# EAGLE design IoT_modules_atmega328_kinemata_v2 (EAGLE 7.2.0)
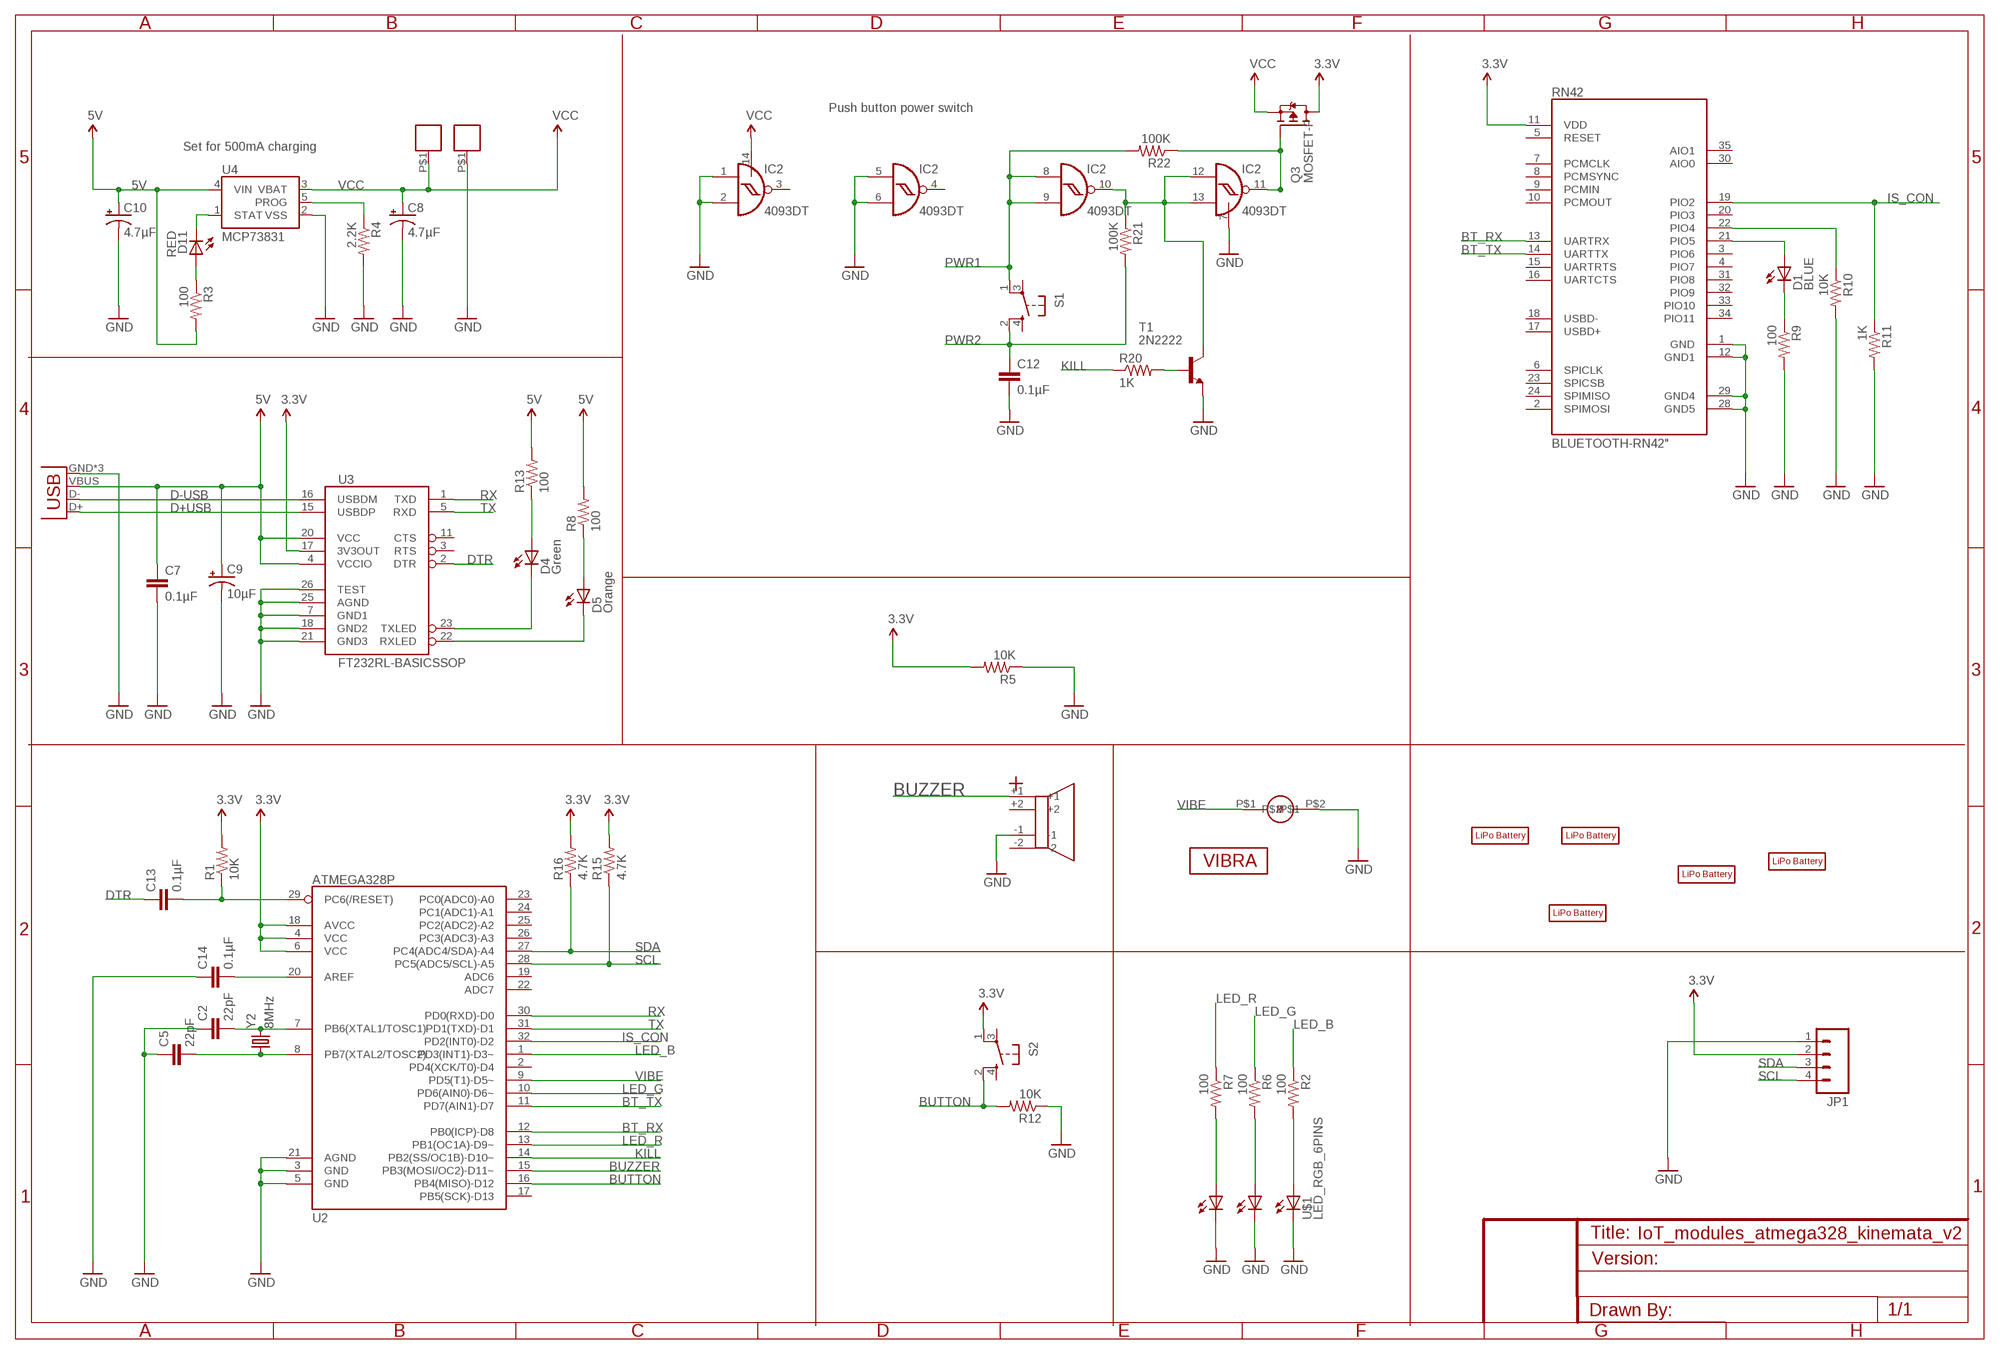
[diagram p0: schematic, sheet 1]

## Parts
BAT+2  LIPO_PAD  [LIPO_PAD]
BAT-1  LIPO_PAD  [LIPO_PAD]
C2  22pF  CAP1206  [1206]
C5  22pF  CAP1206  [1206]
C7  0.1µF  CAP1206  [1206]
C8  4.7µF  CAP_POL1206  [EIA3216]
C9  10µF  CAP_POL1206  [EIA3216]
C10  4.7µF  CAP_POL1206  [EIA3216]
C12  0.1µF  CAP1206  [1206]
C13  0.1µF  CAP1206  [1206]
C14  0.1µF  CAP1206  [1206]
D1  BLUE  LED1206  [LED-1206]
D4  Green  LED1206  [LED-1206]
D5  Orange  LED1206  [LED-1206]
D11  RED  LED1206  [LED-1206]
IC2  4093DT  [MC14093B-TSSOP14]
JP1  M04LONGPADS  [1X04_LONGPADS]
JP6  USB-MICROB  [USB-MICROB]
Q3  MOSFET-P  [SOT23]
R1  10K  RESISTOR1206  [1206]
R2  100  RESISTOR1206  [1206]
R3  100  RESISTOR1206  [1206]
R4  2.2K  RESISTOR1206  [1206]
R5  10K  RESISTOR1206  [1206]
R6  100  RESISTOR1206  [1206]
R7  100  RESISTOR1206  [1206]
R8  100  RESISTOR1206  [1206]
R9  100  RESISTOR1206  [1206]
R10  10K  RESISTOR1206  [1206]
R11  1K  RESISTOR1206  [1206]
R12  10K  RESISTOR1206  [1206]
R13  100  RESISTOR1206  [1206]
R15  4.7K  RESISTOR1206  [1206]
R16  4.7K  RESISTOR1206  [1206]
R20  1K  RESISTOR1206  [1206]
R21  100K  RESISTOR1206  [1206]
R22  100K  RESISTOR1206  [1206]
RN42  BLUETOOTH-RN42"  [RN42]
S1  TAC_SWITCH_SIDEWAY  [TACTILE_SWITCH_ANGLE_SMD]
S2  TAC_SWITCH_SIDEWAY  [TACTILE_SWITCH_ANGLE_SMD]
T1  2N2222  [TO92-EBC-OVAL]
U2  ATMEGA328P  ATMEGA328_SMT  [TQFP32-08]
U3  FT232RL-BASICSSOP  [SSOP28DB]
U4  MCP73831  [SOT23-5]
U$1  LED_RGB_6PINS  [LED_RGB_6PINS]
U$2  LIPO_BATTERY110MAH  [LIPO_BATTERY_110MAH]
U$3  BUZZER_4PINS  [FARNELL_BUZZER_MAGNETIC_SMD_3V_2215091]
U$4  VIBRATION_MOTOR_SHAPE  [VIBRATION_MOTOR_SHAPE]
U$5  VIBRATION_MOTOR  [VIBRATION_MOTOR_CABLE]
U$6  LIPO_BATTERY300MAH  [LIPO_BATTERY_300MAH_FARNELL_2077884]
U$7  LIPO_BATTERY400MAH  [LIPO_BATTERY_400MAH]
U$8  LIPO_BATTERY600MAH  [LIPO_BATTERY_600MAH_FARNELL_2077883]
U$9  LIPO_BATTERY900MAH  [LIPO_BATTERY_900MAH]
Y2  8MHz  CRYSTAL_2PINS5X3.2  [CRYSTAL_8MHZ_SMD_FARNELL_2101329]

## Nets
3.3V: JP1.2 Q3.3(D) R1.2 R5.2 R15.2 R16.2 RN42.11(VDD) S2.1(A2) U2.4(VCC) U2.6(VCC) U2.18(AVCC) U3.17(3V3OUT)
5V: C7.1 C9.A(+) C10.A(+) JP6.VBUS R3.2 R8.2 R13.2 U3.4(VCCIO) U3.20(VCC) U4.4(VIN)
BT_RX: RN42.13(UARTRX) U2.12(PB0(ICP)-D8)
BT_TX: RN42.14(UARTTX) U2.11(PD7(AIN1)-D7)
BUTTON: R12.2 S2.2(B2) U2.16(PB4(MISO)-D12)
BUZZER: U2.15(PB3(MOSI/OC2)-D11~) U$3.+1
D+USB: JP6.D+ U3.15(USBDP)
D-USB: JP6.D- U3.16(USBDM)
DTR: C13.1 U3.2(DTR)
GND: BAT-1.P$1 C2.1 C5.1 C7.2 C8.C(-) C9.C(-) C10.C(-) C12.2 C14.1 IC2.1 IC2.2 IC2.5 IC2.6 IC2.7 JP1.1 JP6.GND JP6.MT1(GND) JP6.MT2(GND) R4.2 R5.1 R9.2 R10.2 R11.2 R12.1 RN42.1(GND) RN42.12(GND1) RN42.28(GND5) RN42.29(GND4) T1.E U2.3(GND) U2.5(GND) U2.21(AGND) U3.7(GND1) U3.18(GND2) U3.21(GND3) U3.25(AGND) U3.26(TEST) U4.2(VSS) U$1.BC U$1.GC U$1.RC U$3.-1 U$5.P$2
IS_CON: R11.1 RN42.19(PIO2) U2.32(PD2(INT0)-D2)
KILL: R20.1 U2.14(PB2(SS/OC1B)-D10~)
LED_B: R2.1 U2.1(PD3(INT1)-D3~)
LED_G: R6.1 U2.10(PD6(AIN0)-D6~)
LED_R: R7.1 U2.13(PB1(OC1A)-D9~)
N$1: R7.2 U$1.BA
N$2: R2.2 U$1.GA
N$3: D11.A R3.1
N$4: R6.2 U$1.RA
N$7: D4.A R13.1
N$9: D5.A R8.1
N$12: R10.1 RN42.22(PIO4)
N$13: D1.A RN42.21(PIO5)
N$14: C5.2 U2.8(PB7(XTAL2/TOSC2)) Y2.P$1
N$16: C2.2 U2.7(PB6(XTAL1/TOSC1)) Y2.P$2
N$17: D1.C R9.1
N$18: C13.2 R1.1 U2.29(PC6(/RESET))
N$19: C14.2 U2.20(AREF)
N$23: IC2.10 IC2.12 IC2.13 R21.1 T1.C
N$24: R20.2 T1.B
N$27: IC2.11 Q3.1(G) R22.1
PROG: R4.1 U4.5(PROG)
PWR1: IC2.8 IC2.9 R22.2 S1.1(A2)
PWR2: C12.1 R21.2 S1.2(B2)
RX: U2.30(PD0(RXD)-D0) U3.1(TXD)
RXLED: D5.C U3.22(RXLED)
SCL: JP1.4 R15.1 U2.28(PC5(ADC5/SCL)-A5)
SDA: JP1.3 R16.1 U2.27(PC4(ADC4/SDA)-A4)
STAT: D11.C U4.1(STAT)
TX: U2.31(PD1(TXD)-D1) U3.5(RXD)
TXLED: D4.C U3.23(TXLED)
VCC: BAT+2.P$1 C8.A(+) IC2.14 Q3.2(S) U4.3(VBAT)
VIBE: U2.9(PD5(T1)-D5~) U$5.P$1
Unconnected: IC2.3 IC2.4 RN42.2(SPIMOSI) RN42.3(PIO6) RN42.4(PIO7) RN42.5(RESET) RN42.6(SPICLK) RN42.7(PCMCLK) RN42.8(PCMSYNC) RN42.9(PCMIN) RN42.10(PCMOUT) RN42.15(UARTRTS) RN42.16(UARTCTS) RN42.17(USBD+) RN42.18(USBD-) RN42.20(PIO3) RN42.23(SPICSB) RN42.24(SPIMISO) RN42.30(AIO0) RN42.31(PIO8) RN42.32(PIO9) RN42.33(PIO10) RN42.34(PIO11) RN42.35(AIO1) S1.3(A1) S1.4(B1) S2.3(A1) S2.4(B1) U2.2(PD4(XCK/T0)-D4) U2.17(PB5(SCK)-D13) U2.19(ADC6) U2.22(ADC7) U2.23(PC0(ADC0)-A0) U2.24(PC1(ADC1)-A1) U2.25(PC2(ADC2)-A2) U2.26(PC3(ADC3)-A3) U3.3(RTS) U3.11(CTS) U$3.+2 U$3.-2

## Notes on the sheet
- Push button power switch
- Set for 500mA charging

## Library data of the parts
BAT+2 BAT-1 = MlabPaja_v3:LIPO_PAD
C2 C5 C7 C12-C14 = SparkFun-Passives:CAP: Capacitor Standard 0603 ceramic capacitor, and 0.1" leaded capacitor.
C8-C10 = SparkFun-Passives:CAP_POL: Capacitor Polarized These are standard SMD and PTH capacitors. Normally 10uF, 47uF, and 100uF in electrolytic and tantalum varieties. Always verify the external diameter of the through hole cap, it varies with capacity, voltage, and manufacturer. The EIA devices should be standard.
D1 D4 D5 D11 = SparkFun-LED:LED: LEDs Standard schematic elements and footprints for 5mm, 3mm, 1206, and 0603 sized LEDs. 5mm - Spark Fun Electronics SKU : COM-00529 (and others)
IC2 = MlabPaja_v3:4093: Quad 2-input NAND schmitt trigger
JP1 = SparkFun-Connectors:M04: Header 4 Standard 4-pin 0.1" header. Use with straight break away headers (SKU : PRT-00116), right angle break away headers (PRT-00553), swiss pins (PRT-00743), machine pins (PRT-00117), and female headers (PRT-00115). Molex polarized connector foot print use with SKU : PRT-08231 with associated crimp pins and housings. 1MM SMD Version SKU: PRT-10208
JP6 = SparkFun-Connectors:USB: USB Connectors USB-B-PTH is fully proven SKU : PRT-00139/CONN-08278 USB-miniB is fully proven SKU : PRT-00587 USB-A-PCB is untested. USB-A-H is throughly reviewed, but untested. Spark Fun Electronics SKU : PRT-00437 USB-B-SMT is throughly reviewed, but untested. Needs silkscreen touching up. USB-A-S has not been used/tested USB-MB-H has not been used/tested USB-MICROB has been used. CONN-09505; PROD_ID: CONN-09505
Q3 = MlabPaja_v3:MOSFET-P
R1-R13 R15 R16 R20-R22 = SparkFun-Resistors:RESISTOR: Resistor Basic schematic elements and footprints for 0603, 1206, and PTH resistors.
RN42 = MlabPaja_v3:BLUETOOTH-RN42: Bluetooth SMD module
S1 S2 = MlabPaja_v3:TAC_SWITCH: Momentary Switch Button commonly used for reset or general input. Spark Fun Electronics SKU : COM-00097 SMT- SWCH-08247; PROD_ID: SWCH-08247
T1 = adafruit:2N2222: NPN TRANSISTOR Big oval pads
U2 = MlabPaja_v3:ATMEGA328_SMT: 32-Pin Atmega328 part Commonly used on Arduino compatible boards Available in QFP and QFN packages TQFP is IC-09069 QFN is non-stock; PROD_ID: IC-09069
U3 = SparkFun-DigitalIC:FT232RL-BASIC: USB UART This is the simplified version of the FT232RL unit. Only what you need, nothing you don't. Spark Fun Electronics SKU : COM-00650
U4 = SparkFun:MCP73831: Microchip's MCP73831 Miniature single cell, fully integrated Li-Ion, Li-polymer charge management controller http://ww1.microchip.com/downloads/en/DeviceDoc/21984a.pdf
U$1 = Mlab_ProEx2015:LED_RGB_6PINS
U$2 U$6-U$9 = MlabPaja_v3:LIPO_BATTERY
U$3 = MlabPaja_v2:BUZZER_4PINS
U$4 = MlabPaja_v3:VIBRATION_MOTOR_SHAPE
U$5 = MlabPaja_v3:VIBRATION_MOTOR
Y2 = MlabPaja_v2:CRYSTAL_2PINS

## Net classes
0 default: clearance 0.21 mm

## Board
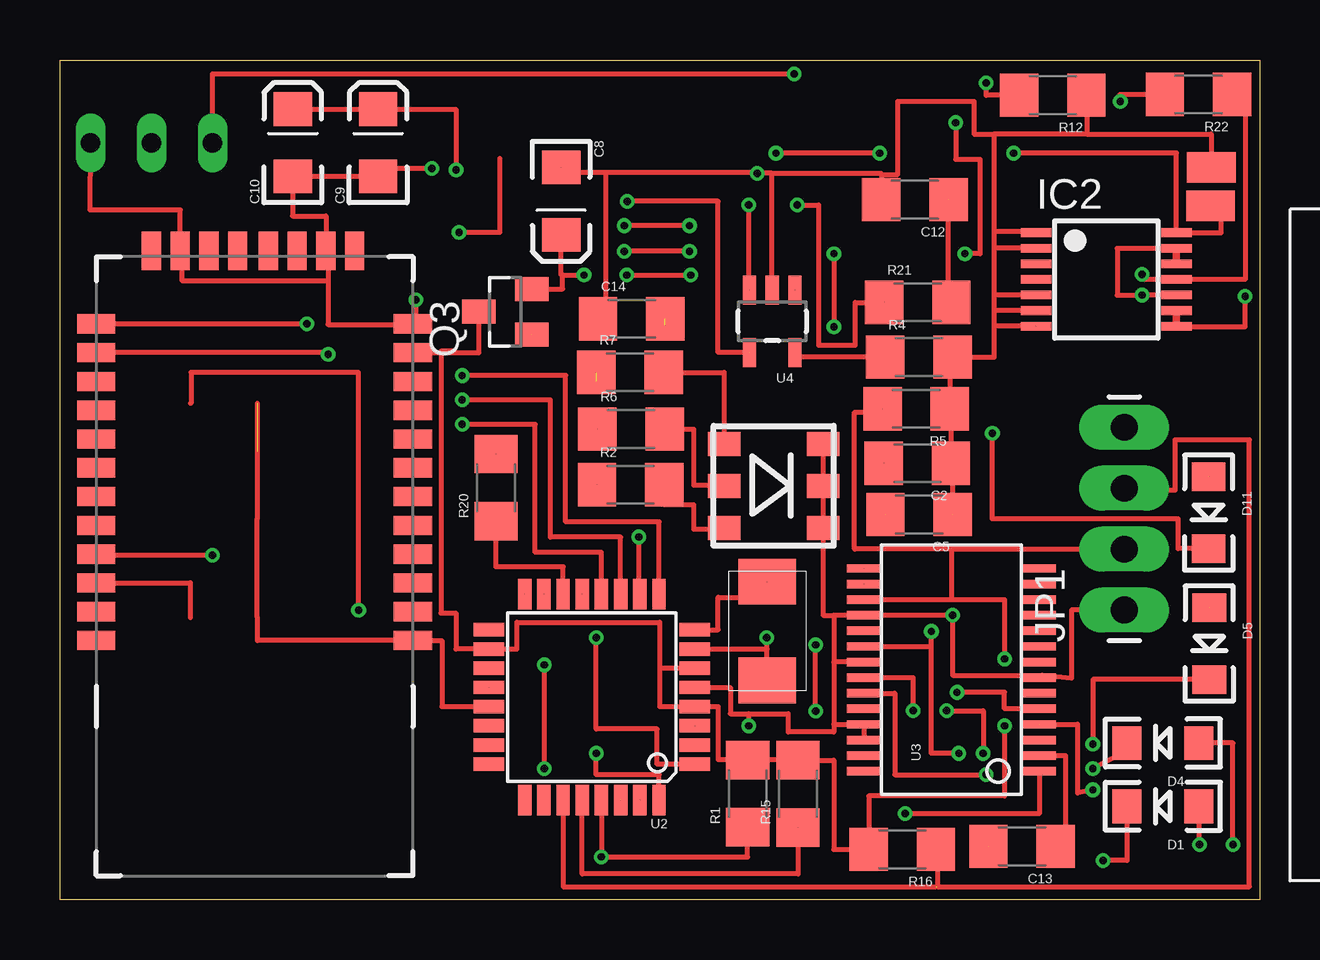
[diagram p1: board, top side]
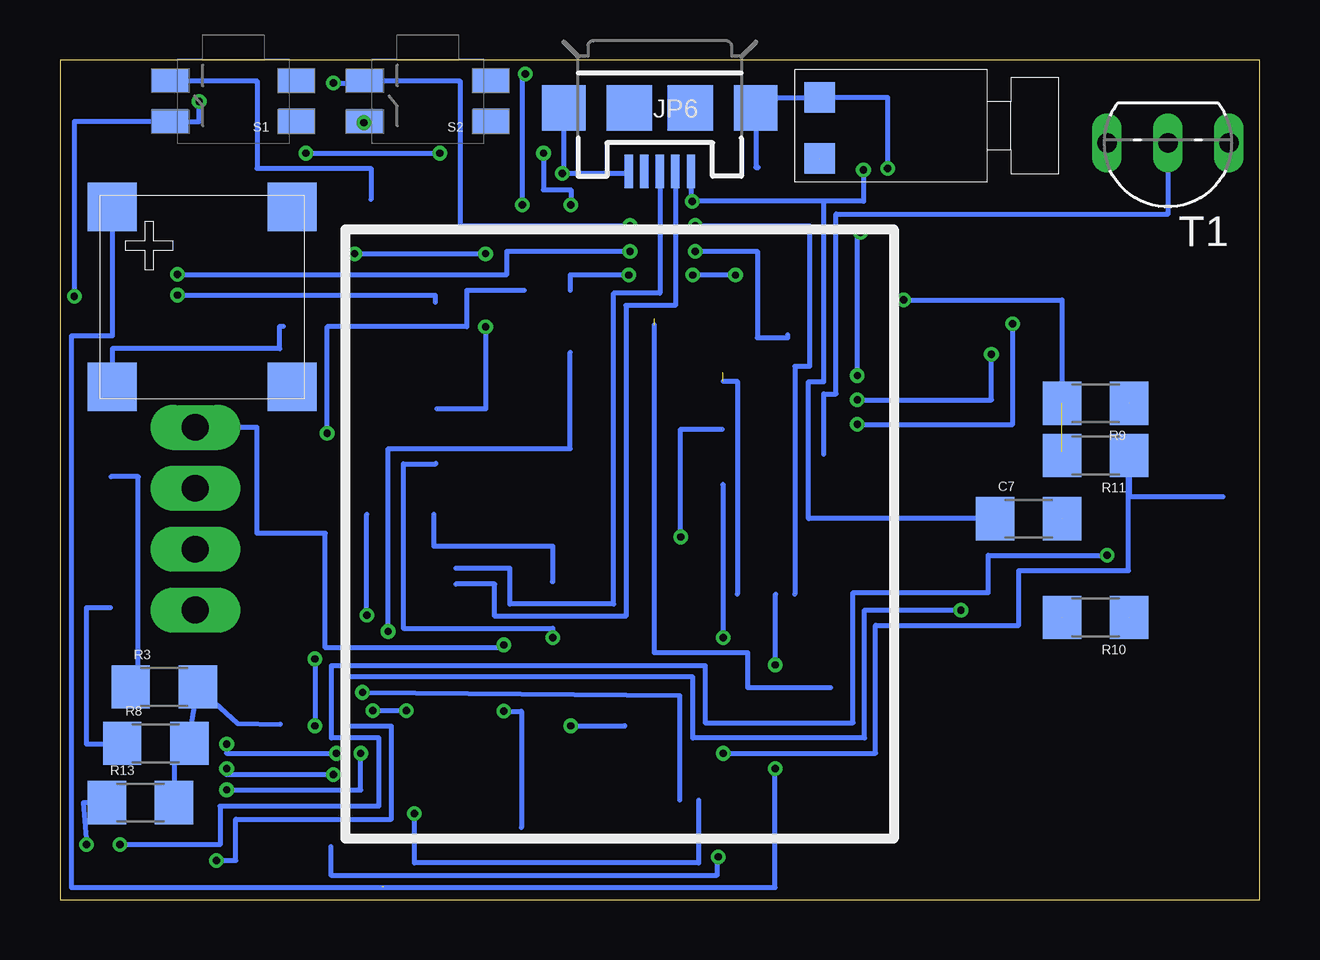
[diagram p2: board, bottom side, seen from below]

Size 50 x 35 mm. Coordinates in mm from the lower left corner, seen from the top.
Outline: 0,0 0,35 50,35 50,0 0,0
Copper layers (1*16): Top 0.035mm / dielectric 0.2mm / Bottom 0.035mm
Design rules "SeeedStudio_DRU_no_angle_20130527_modified": minimum track width 6mil, minimum drill 12mil, track to track 6mil, track to pad 6mil, pad to pad 6mil, via to via 6mil, smd to smd 0mil, copper to edge 10mil, drill to drill 10mil, minimum pad ring 6mil, minimum via ring 6mil, stop-mask expansion 2mil, vias tented up to drill 25mil, thermal gap 10mil

### Footprints (pad centres in the part's own frame; a part is rotated, then mirrored left to right if it is on the bottom)
LIPO_PAD = smd 2.032 x 1.27: P$1 0,0
1206 = smd 1.6 x 1.8: 1 -1.4,0; 2 1.4,0
EIA3216 = smd 1.4 x 1.6: A 1.4,0; C -1.4,0
LED-1206 = smd 1.2 x 1.4: A -1.5,0; C 1.5,0
MC14093B-TSSOP14 = smd 0.36 x 1.26: 1 -1.95,-2.925; 2 -1.3,-2.925; 3 -0.65,-2.925; 4 0,-2.925; 5 0.65,-2.925; 6 1.3,-2.925; 7 1.95,-2.925; 8 1.95,2.925; 9 1.3,2.925; 10 0.65,2.925; 11 0,2.925; 12 -0.65,2.925; 13 -1.3,2.925; 14 -1.95,2.925
1X04_LONGPADS = drill 1.118 pad 1.88 long: 1 0,0; 2 2.54,0; 3 5.08,0; 4 7.62,0
USB-MICROB = smd 0.35 x 1.4: D+ 0,2.65; D- -0.65,2.65; GND 1.3,2.65; ID 0.65,2.65; VBUS -1.3,2.65 | smd 1.8 x 1.9: MT1 -4,0; MT2 4,0 | smd 1.9 x 1.9: P$1 -1.27,0; P$2 1.27,0
SOT23 = smd 1 x 1.4: 1 -0.95,-1.1; 2 0.95,-1.1; 3 0,1.1
RN42 = smd 0.8 x 1.6: 1 -6.6,-6.6; 2 -5.4,-6.6; 3 -4.2,-6.6; 4 -3,-6.6; 5 -1.8,-6.6; 6 -0.6,-6.6; 7 0.6,-6.6; 8 1.8,-6.6; 9 3,-6.6; 10 4.2,-6.6; 11 5.4,-6.6; 12 6.6,-6.6; 13 6.6,6.6; 14 5.4,6.6; 15 4.2,6.6; 16 3,6.6; 17 1.8,6.6; 18 0.6,6.6; 19 -0.6,6.6; 20 -1.8,6.6; 21 -3,6.6; 22 -4.2,6.6; 23 -5.4,6.6; 24 -6.6,6.6 | smd 1.6 x 0.8: 28 9.65,3.1; 29 9.65,-2.973; 30 9.65,4.3; 31 9.65,1.9; 32 9.65,0.7; 33 9.65,-0.573; 34 9.65,-1.773; 35 9.65,-4.173
TACTILE_SWITCH_ANGLE_SMD = smd 1.524 x 1.016: 1 2.642,1.067; 2 2.642,-0.635; 3 -2.642,1.041; 4 -2.642,-0.635
TO92-EBC-OVAL = drill 0.813 long: B 0,-1.27; C 2.54,-1.27; E -2.54,-1.27
TQFP32-08 = smd 1.27 x 0.559: 1 -4.293,2.8; 2 -4.293,2; 3 -4.293,1.2; 4 -4.293,0.4; 5 -4.293,-0.4; 6 -4.293,-1.2; 7 -4.293,-2; 8 -4.293,-2.8; 17 4.293,-2.8; 18 4.293,-2; 19 4.293,-1.2; 20 4.293,-0.4; 21 4.293,0.4; 22 4.293,1.2; 23 4.293,2; 24 4.293,2.8 | smd 0.559 x 1.27: 9 -2.8,-4.293; 10 -2,-4.293; 11 -1.2,-4.293; 12 -0.4,-4.293; 13 0.4,-4.293; 14 1.2,-4.293; 15 2,-4.293; 16 2.8,-4.293; 25 2.8,4.293; 26 2,4.293; 27 1.2,4.293; 28 0.4,4.293; 29 -0.4,4.293; 30 -1.2,4.293; 31 -2,4.293; 32 -2.8,4.293
SSOP28DB = smd 0.348 x 1.397: 1 -4.225,-3.656; 2 -3.575,-3.656; 3 -2.925,-3.656; 4 -2.275,-3.656; 5 -1.625,-3.656; 6 -0.975,-3.656; 7 -0.325,-3.656; 8 0.325,-3.656; 9 0.975,-3.656; 10 1.625,-3.656; 11 2.275,-3.656; 12 2.925,-3.656; 13 3.575,-3.656; 14 4.225,-3.656; 15 4.225,3.656; 16 3.575,3.656; 17 2.925,3.656; 18 2.275,3.656; 19 1.625,3.656; 20 0.975,3.656; 21 0.325,3.656; 22 -0.325,3.656; 23 -0.975,3.656; 24 -1.625,3.656; 25 -2.275,3.656; 26 -2.925,3.656; 27 -3.575,3.656; 28 -4.225,3.656
SOT23-5 = smd 0.55 x 1.2: 1 -0.95,-1.3; 2 0,-1.3; 3 0.95,-1.3; 4 0.95,1.3; 5 -0.95,1.3
LED_RGB_6PINS = smd 1 x 1.35: BA -1.749,-2.07; BC -1.749,2.07; GA 1.751,-2.07; GC 1.751,2.07; RA 0.001,-2.07; RC 0.001,2.07
FARNELL_BUZZER_MAGNETIC_SMD_3V_2215091 = smd 2.032 x 2.032: +1 -3.607,3.861; +2 3.893,3.861; -1 -3.607,-3.639; -2 3.893,-3.639
VIBRATION_MOTOR_CABLE = smd 1.27 x 1.27: P$1 -1.27,0; P$2 1.27,0
CRYSTAL_8MHZ_SMD_FARNELL_2101329 = smd 1.9 x 2.4: P$1 -2.184,0.076; P$2 1.93,0.076

### Placement (x,y rotation side)
BAT+2  47.96,28.91 0 top
BAT-1  47.99,30.52 180 top
C2  35.74,18.19 180 top
C5  35.81,16.05 180 top
C7  9.63,15.88 0 bottom
C8  20.89,29.11 270 top
C9  13.26,31.55 90 top
C10  9.7,31.55 90 top
C12  35.64,29.18 180 top
C13  40.1,2.22 180 top
C14  23.83,24.21 0 top
D1  45.97,3.89 180 top
D4  45.97,6.53 180 top
D5  47.9,10.67 270 top
D11  47.88,16.13 270 top
IC2  43.61,25.85 270 top
JP1  44.36,12.07 90 top
JP6  25,33 180 bottom
Q3  18.56,24.5 90 top
R1  28.66,4.42 90 top
R2  23.78,17.3 0 top
R3  45.65,8.86 0 bottom
R4  35.8,22.61 0 top
R5  35.69,20.46 180 top
R6  23.8,19.61 0 top
R7  23.76,21.98 0 top
R8  46.01,6.51 0 bottom
R9  6.83,20.69 180 bottom
R10  6.83,11.76 180 bottom
R11  6.83,18.52 180 bottom
R12  41.38,33.53 180 top
R13  46.64,4.04 0 bottom
R15  30.77,4.4 90 top
R16  35.11,2.09 180 top
R20  18.18,17.17 90 top
R21  35.76,24.9 0 top
R22  47.45,33.56 180 top
RN42  8.11,17.4 90 top
S1  42.77,33.5 180 bottom
S2  34.67,33.5 180 bottom
T1  3.82,30.27 180 bottom
U2  22.17,8.44 180 top
U3  37.16,9.58 90 top
U4  29.69,24.1 180 top
U$1  29.75,17.25 270 top
U$2  56.93,16.02 90 top  (outside the outline)
U$3  44.21,25.02 0 bottom
U$4  14.67,32.38 180 bottom
U$5  18.34,32.16 90 bottom
U$6  -0.5,-37.75 0 top  (outside the outline)
U$7  -1.25,-80.5 0 top  (outside the outline)
U$8  -2.25,-99.25 0 top  (outside the outline)
U$9  -3,-149 0 top  (outside the outline)
Y2  29.4,11.06 270 top

### Tracks (layer width: path | path; a pad name or v marks a point on that pad's centre or on a via)
3.3V  (via drill 0.3 pad 0.2)  (1 unrouted)
  Top 0.203: RN42.11 16.46,22.8 | 16.46,22.8 17.46,22.8 Q3.3 | 24.99,9.64 24.99,11.56 19.05,11.56 19.05,10.44 U2.18 16.51,10.44 16.51,11.94 15.88,11.94 15.88,22.86 16.46,22.86 16.46,22.8 | 24.99,9.64 24.99,8.04 U2.4 27.43,8.04 27.43,5.84 28.66,5.84 R1.2 30.77,5.82 R15.2 32.26,5.8 32.26,2.09 R16.2 33.71,4.32 39.37,4.32 v39.37,7.24 | U2.6 24.99,9.64 | 37.19,14.61 37.19,12.5 U3.17 39.37,12.5 v39.37,10.03 | 37.19,14.61 JP1.2 | 37.19,14.61 33.12,14.61 33.12,20.32 34.29,20.32 R5.2 | v37.34,32.38 37.34,30.86 38.35,30.86 38.35,26.92 v37.72,26.92 | v32.26,26.92 v32.26,23.88
  Bottom 0.203: v39.37,10.03 v39.37,7.24 | S2.1 37.31,32.51 37.34,32.51 v37.34,32.38 | v37.72,26.92 v32.26,26.92 | v32.26,23.88 32.26,20.46 R5.2
5V  (via drill 0.3 pad 0.2)  (2 unrouted)
  Top 0.203: U4.4 27.43,22.8 27.43,29.11 v23.65,29.11 | C10.A C9.A 16.51,32.95 v16.51,30.42 | U3.4 42.42,7.3 42.42,4.45 v43.05,4.57 | v37.47,6.1 36.32,6.1 36.32,10.55 | U3.20 36.32,10.55 | 36.32,10.55 v36.32,11.18
  Bottom 0.203: C7.1 18.8,15.88 18.8,21.59 18.16,21.59 18.16,29.11 | 18.16,29.11 v23.65,29.11 23.7,29.11 JP6.VBUS | U3.4 42.59,7.34 R3.2 44.48,7.59 R8.2 45.24,6.51 R13.2 | v16.51,30.42 16.51,29.11 18.16,29.11 | v43.05,4.57 37.47,4.57 v37.47,6.1 | v36.32,11.18 36.32,18.8 28.74,18.8 U4.4
BT_RX  (via drill 0.3 pad 0.2)
  Top 0.203: U2.12 22.57,14.48 19.81,14.48 19.81,19.81 v16.76,19.81 | v10.29,24 RN42.13
  Bottom 0.203: v16.76,19.81 10.29,19.81 v10.29,24
BT_TX  (via drill 0.3 pad 0.2)
  Top 0.203: U2.11 23.37,15.11 20.45,15.11 20.45,20.83 v16.76,20.83 | v11.18,22.73 11.18,22.8 RN42.14
  Bottom 0.203: v16.76,20.83 11.18,20.83 v11.18,22.73
BUTTON  (via drill 0.3 pad 0.2)  (1 unrouted)
  Top 0.203: v26.24,28.09 v23.52,28.09 | R12.2 38.61,33.53 v38.61,34.04
  Bottom 0.203: v26.24,28.09 33.33,28.09 33.33,34.13 S2.2 37.31,34.04 v38.61,34.04 | v23.52,28.09 18.76,28.09 18.76,22.23 19.37,22.23 U2.16
BUZZER  (via drill 0.3 pad 0.2)  (1 unrouted)
  Top 0.203: v20.19,5.46 v20.19,9.78
  Bottom 0.203: U$3.+1 47.82,23.5 49.53,23.5 49.53,0.51 20.19,0.51 v20.19,5.46 | v20.19,9.78 20.17,9.78 U2.15
D+USB  (1 unrouted)
  Bottom 0.203: JP6.D+ 25,25.27 26.92,25.27 26.92,12.32 31.24,12.32 31.24,13.8 U3.15
D-USB  (1 unrouted)
  Bottom 0.203: JP6.D- 24.35,24.77 26.42,24.77 26.42,11.81 31.88,11.81 31.88,13.15 U3.16
DTR
  Top 0.203: U3.2 41.91,6 41.91,2.54 41.5,2.54 C13.1
GND  (via drill 0.3 pad 0.2)  (8 unrouted)
  Top 0.203: v14.83,24.99 14.83,24 RN42.12 14.71,23.98 11.18,23.98 11.18,25.81 | 11.18,25.81 11.18,27.05 RN42.29 11.09,28.5 9.69,28.5 C10.C C9.C 13.26,30.48 v15.49,30.48 | 11.18,25.81 5.08,25.81 5.08,27.05 RN42.28 5.01,28.75 1.26,28.75 T1.E | U2.21 15.93,8.04 15.93,10.8 RN42.1 8.23,10.8 R10.2 C7.2 R9.2 | U3.26 U3.25 32.26,7.3 | 40.94,9.35 37.21,9.35 v37.21,11.85 U3.18 32.26,11.85 | U$1.BC U$1.RC U$1.GC 31.82,11.85 32.26,11.85 | C2.1 37.14,20.46 R5.1 37.09,22.61 R4.2 38.94,22.61 38.94,23.9 | C2.1 37.21,18.19 C5.1 | JP1.1 42.16,12.07 42.16,9.22 40.94,9.35 | 40.94,9.35 U3.7 | U4.2 29.67,25.4 29.67,30.28 | 29.67,30.28 v29.06,30.28 29.06,30.32 22.76,30.32 | C14.1 22.76,23.96 22.76,30.32 | 38.94,23.9 38.94,24.55 | 38.94,24.55 38.94,25.2 | 38.94,25.2 38.94,27.15 | 38.94,27.15 38.94,27.84 | 38.94,27.84 38.94,31.91 | IC2.1 40.64,27.8 40.64,27.84 38.94,27.84 | IC2.2 38.94,27.15 | IC2.5 38.94,25.2 | IC2.7 38.94,23.9 | IC2.6 38.94,24.55 | C2.1 37.19,18.19 37.19,18.09 | 42.8,31.91 38.94,31.91 | R12.1 42.8,33.15 42.8,31.91 | C8.C 20.89,30.32 22.76,30.32 | 32.26,11.85 32.26,9.9 | 32.26,9.9 32.26,7.3 | 32.26,7.3 32.26,6.99 30.35,6.99 30.35,7.75 28.7,7.75 | U2.5 27.94,8.84 27.94,7.75 28.7,7.75 | 28.7,7.75 v28.7,7.24 | U3.21 32.26,9.9 | 42.8,31.91 47.99,31.91 BAT-1.P$1 | 29.67,30.28 34.24,30.28 34.24,30.23 | 34.29,29.18 C12.2 34.24,30.23 | 38.94,31.91 38.1,31.91 38.1,33.27 34.92,33.27 34.92,30.23 34.24,30.23
  Bottom 0.203: v14.83,24.99 8.23,24.99 R9.2 | 29.06,33 JP6.MT2 29,30.28 v29.06,30.28 26.3,30.28 JP6.GND | U$3.-1 47.82,22.96 40.84,22.96 40.84,23.9 IC2.7 | C8.C 21,30.51 JP6.MT1 21,33.43 U$5.P$2 15.49,33.43 v15.49,30.48 | v28.7,7.24 U2.3 | v37.21,11.85 C5.1 | R11.2 8.23,18.67
  cutout Bottom: -1.27,36.83 50.8,36.83 50.8,-1.27 15.24,-1.27 15.24,10.16 -1.27,10.16
  cutout Top: -1.27,36.83 -1.27,10.16 15.24,10.16 15.24,-1.27 50.8,-1.27 50.8,36.83
IS_CON  (via drill 0.3 pad 0.2)  (1 unrouted)
  Top 0.203: U2.32 24.97,5.21 22.35,5.21 v22.35,6.1
  Bottom 0.203: v22.35,6.1 16,6.1 16,11.43 10.03,11.43 10.03,13.72 5.46,13.72 5.46,18.52 R11.1 5.43,16.8 RN42.19
KILL
  Top 0.203: U2.14 20.97,13.87 18.18,13.87 R20.1
LED_B  (via drill 0.3 pad 0.2)  (1 unrouted)
  Top 0.203: U2.1 24.89,5.64 24.89,7.11 22.35,7.11 v22.35,10.92
  Bottom 0.203: v22.35,10.92 22.35,17.3 R2.1
LED_G  (via drill 0.3 pad 0.2)  (1 unrouted)
  Top 0.203: U2.10 24.13,12.73 v24.13,15.11
  Bottom 0.203: v24.13,15.11 24.13,19.61 R6.1
LED_R  (2 unrouted)
  Bottom 0.203: 22.36,21.6 21.77,21.6 U2.13
N$1
  Top 0.203: R7.2 27.68,21.98 U$1.BA
N$2
  Top 0.203: R2.2 25.2,17.04 25.2,16.46 26.42,16.46 26.42,15.44 27.68,15.44 U$1.GA
N$3  (1 unrouted)
  Bottom 0.203: R3.1 46.74,8.86 46.74,17.63 D11.A
N$4
  Top 0.203: R6.2 26.42,19.61 26.42,17.27 27.68,17.27 U$1.RA
N$7  (via drill 0.3 pad 0.2)
  Top 0.203: v48.9,2.29 48.9,6.53 D4.A
  Bottom 0.203: R13.1 49.02,4.04 v48.9,2.29
N$9  (1 unrouted)
  Bottom 0.203: R8.1 48.04,6.48 48.9,6.48 48.9,12.17 D5.A
N$12  (1 unrouted)
  Top 0.203: RN42.22 5.43,13.2 R10.1
N$13  (via drill 0.3 pad 0.2)
  Top 0.203: v47.5,2.29 47.5,3.89 D1.A | v6.35,14.35 1.51,14.35 RN42.21
  Bottom 0.203: v47.5,2.29 43.33,2.29 43.33,3.89 36.7,3.89 36.7,6.73 38.68,6.73 38.68,9.75 23.11,9.75 23.11,7.37 16.94,7.37 16.94,12.8 11.3,12.8 11.3,14.35 v6.35,14.35
N$14  (2 unrouted)
  Top 0.203: U2.8 27.43,11.24 27.43,12.6 29.47,12.6 Y2.P$1
  Bottom 0.203: C5.2 34.41,14.73 29.46,14.73 Y2.P$1
N$16  (via drill 0.3 pad 0.2)  (1 unrouted)
  Top 0.203: Y2.P$2 29.47,10.44 | U2.7 29.47,10.44 | 29.47,10.44 29.47,10.92 v29.46,10.92
  Top 0.305: C2.2 34.25,18.19 34.25,18
  Bottom 0.203: C2.2 34.34,18.16 35.69,18.16 35.69,11.3 29.46,11.3 v29.46,10.92
N$17  (via drill 0.3 pad 0.2)  (1 unrouted)
  Top 0.203: D1.C 44.47,1.63 v43.48,1.63 | v12.45,12.06 12.45,21.97 5.46,21.97 5.46,20.69 R9.1
  Bottom 0.203: v43.48,1.63 42.67,1.63 42.67,3.35 36.2,3.35 36.2,7.24 38.1,7.24 38.1,9.27 23.62,9.27 23.62,6.73 16.46,6.73 16.46,12.06 v12.45,12.06
N$18  (via drill 0.3 pad 0.2)  (1 unrouted)
  Top 0.203: 28.7,3.02 R1.1 28.66,1.78 v22.57,1.78 U2.29 | C13.2 38.35,2.22
  Bottom 0.203: C13.2 38.7,1.02 22.61,1.02 22.61,1.78 v22.57,1.78
N$19  (2 unrouted)
  Bottom 0.203: 25.23,23.96 25.23,10.29 21.34,10.29 21.34,8.84 U2.20
N$23  (via drill 0.3 pad 0.2)  (1 unrouted)
  Top 0.203: IC2.10 v45.11,25.2 44.07,25.2 44.07,27.15 IC2.13 | T1.C 6.36,34.42 v30.61,34.42 | v30.73,28.96 31.62,28.96 31.62,23.11 33.15,23.11 33.15,24.89 R21.1 34.36,25.02
  Top 0.305: IC2.12 IC2.13
  Bottom 0.203: v45.11,25.2 34.36,25.2 R21.1 | v30.61,34.42 30.73,34.42 v30.73,28.96
N$24  (1 unrouted)
  Bottom 0.203: T1.B 3.81,31.32 3.81,28.57 17.65,28.57 17.65,21.08 18.18,21.08 R20.2
N$27  (via drill 0.3 pad 0.2)  (1 unrouted)
  Top 0.203: v45.11,26.06 45.11,25.85 IC2.11 49.4,25.85 49.4,33.56 R22.1 | v26.24,27.03 v23.52,27.03
  Bottom 0.203: v45.11,26.06 31.37,26.06 31.37,27.03 v26.24,27.03 | v23.52,27.03 20.93,27.03 20.93,23.42 19.66,23.42 Q3.1
PROG
  Top 0.203: R4.1 30.64,22.61 U4.5
PWR1  (via drill 0.3 pad 0.2)
  Top 0.203: IC2.8 46.54,23.88 49.4,23.88 v49.4,25.15 | v44.2,33.27 44.2,33.56 R22.2
  Top 0.305: IC2.9 IC2.8
  Bottom 0.203: v49.4,25.15 49.4,32.43 S1.1 44.2,32.43 v44.2,33.27
PWR2  (1 unrouted)
  Top 0.203: C12.1 37.04,24.9 R21.2
  Bottom 0.203: S1.2 41.78,34.13 41.78,30.48 37.04,30.48 C12.1
RX  (via drill 0.3 pad 0.2)  (1 unrouted)
  Top 0.203: U3.1 40.82,3.58 v35.23,3.58
  Bottom 0.203: v35.23,3.58 35.23,1.52 23.37,1.52 U2.30
RXLED  (via drill 0.3 pad 0.2)
  Top 0.203: U3.22 35.56,9.25 v35.56,7.87 | v36.96,7.87 38.48,7.87 v38.48,6.1 | D5.C 43.05,9.17 v43.05,6.48
  Bottom 0.203: v35.56,7.87 v36.96,7.87 | v43.05,6.48 43.05,6.1 v38.48,6.1
SCL  (via drill 0.3 pad 0.2)  (1 unrouted)
  Top 0.203: R15.1 30.77,1.07 21.77,1.07 U2.28 | v31.5,7.85 v31.5,10.62
  Bottom 0.203: 44.36,19.71 JP1.4 41.78,19.68 41.78,15.27 38.94,15.27 38.94,10.49 31.5,10.49 v31.5,10.62 | v31.5,7.85 30.77,7.85 R15.1
SDA  (1 unrouted)
  Top 0.203: U2.27 20.97,0.53 36.51,0.53 | R16.1 36.58,1.84 36.58,0.53 49.58,0.53 49.58,19.18 46.48,19.18 46.48,17.07 44.36,17.07 JP1.3
STAT  (via drill 0.3 pad 0.2)  (1 unrouted)
  Top 0.203: D11.C 46.61,14.63 46.61,15.88 38.86,15.88 v38.86,19.43
  Bottom 0.203: v38.86,19.43 38.86,23.88 33.05,23.88 33.05,25.4 U4.1
TX  (via drill 0.3 pad 0.2)  (1 unrouted)
  Top 0.203: U3.5 39.37,7.95 39.37,8.64 v37.39,8.64
  Bottom 0.203: v37.39,8.64 24.17,8.51 U2.31
TXLED  (via drill 0.3 pad 0.2)
  Top 0.203: v43.05,5.46 44.98,6.48 D4.C | U3.23 34.8,8.6 34.8,5.21 v38.61,5.21
  Bottom 0.203: v38.61,5.21 43.05,5.21 v43.05,5.46
VCC  (via drill 0.3 pad 0.2)  (1 unrouted)
  Top 0.203: Q3.2 20.95,25.45 20.95,26.04 | 20.95,26.04 v21.84,26.04 | v23.62,26.04 v26.29,26.04 | 20.95,26.04 20.89,26.04 C8.A | v39.75,31.11 46.54,31.11 IC2.14 48.39,27.8 48.39,28.83 48.51,28.83 48.51,28.78 | v34.16,31.11 v29.84,31.11 | v28.7,28.96 28.7,25.4 U4.3 | BAT+2.P$1 48.51,28.78 | 48.51,28.78 48.51,28.7
  Bottom 0.203: v21.84,26.04 v23.62,26.04 | v26.29,26.04 28.74,26.04 U4.3 | v39.75,31.11 v34.16,31.11 | v29.84,31.11 29.84,29.59 28.7,29.59 v28.7,28.96
VIBE  (via drill 0.3 pad 0.2)  (1 unrouted)
  Top 0.203: U2.9 24.97,15.75 21.08,15.75 21.08,21.84 v16.76,21.84 | v16.64,27.81 18.34,27.81 U$5.P$1
  Bottom 0.203: v16.76,21.84 16.76,27.81 v16.64,27.81